# EAGLE design i2c_relay (EAGLE 9.6.2)
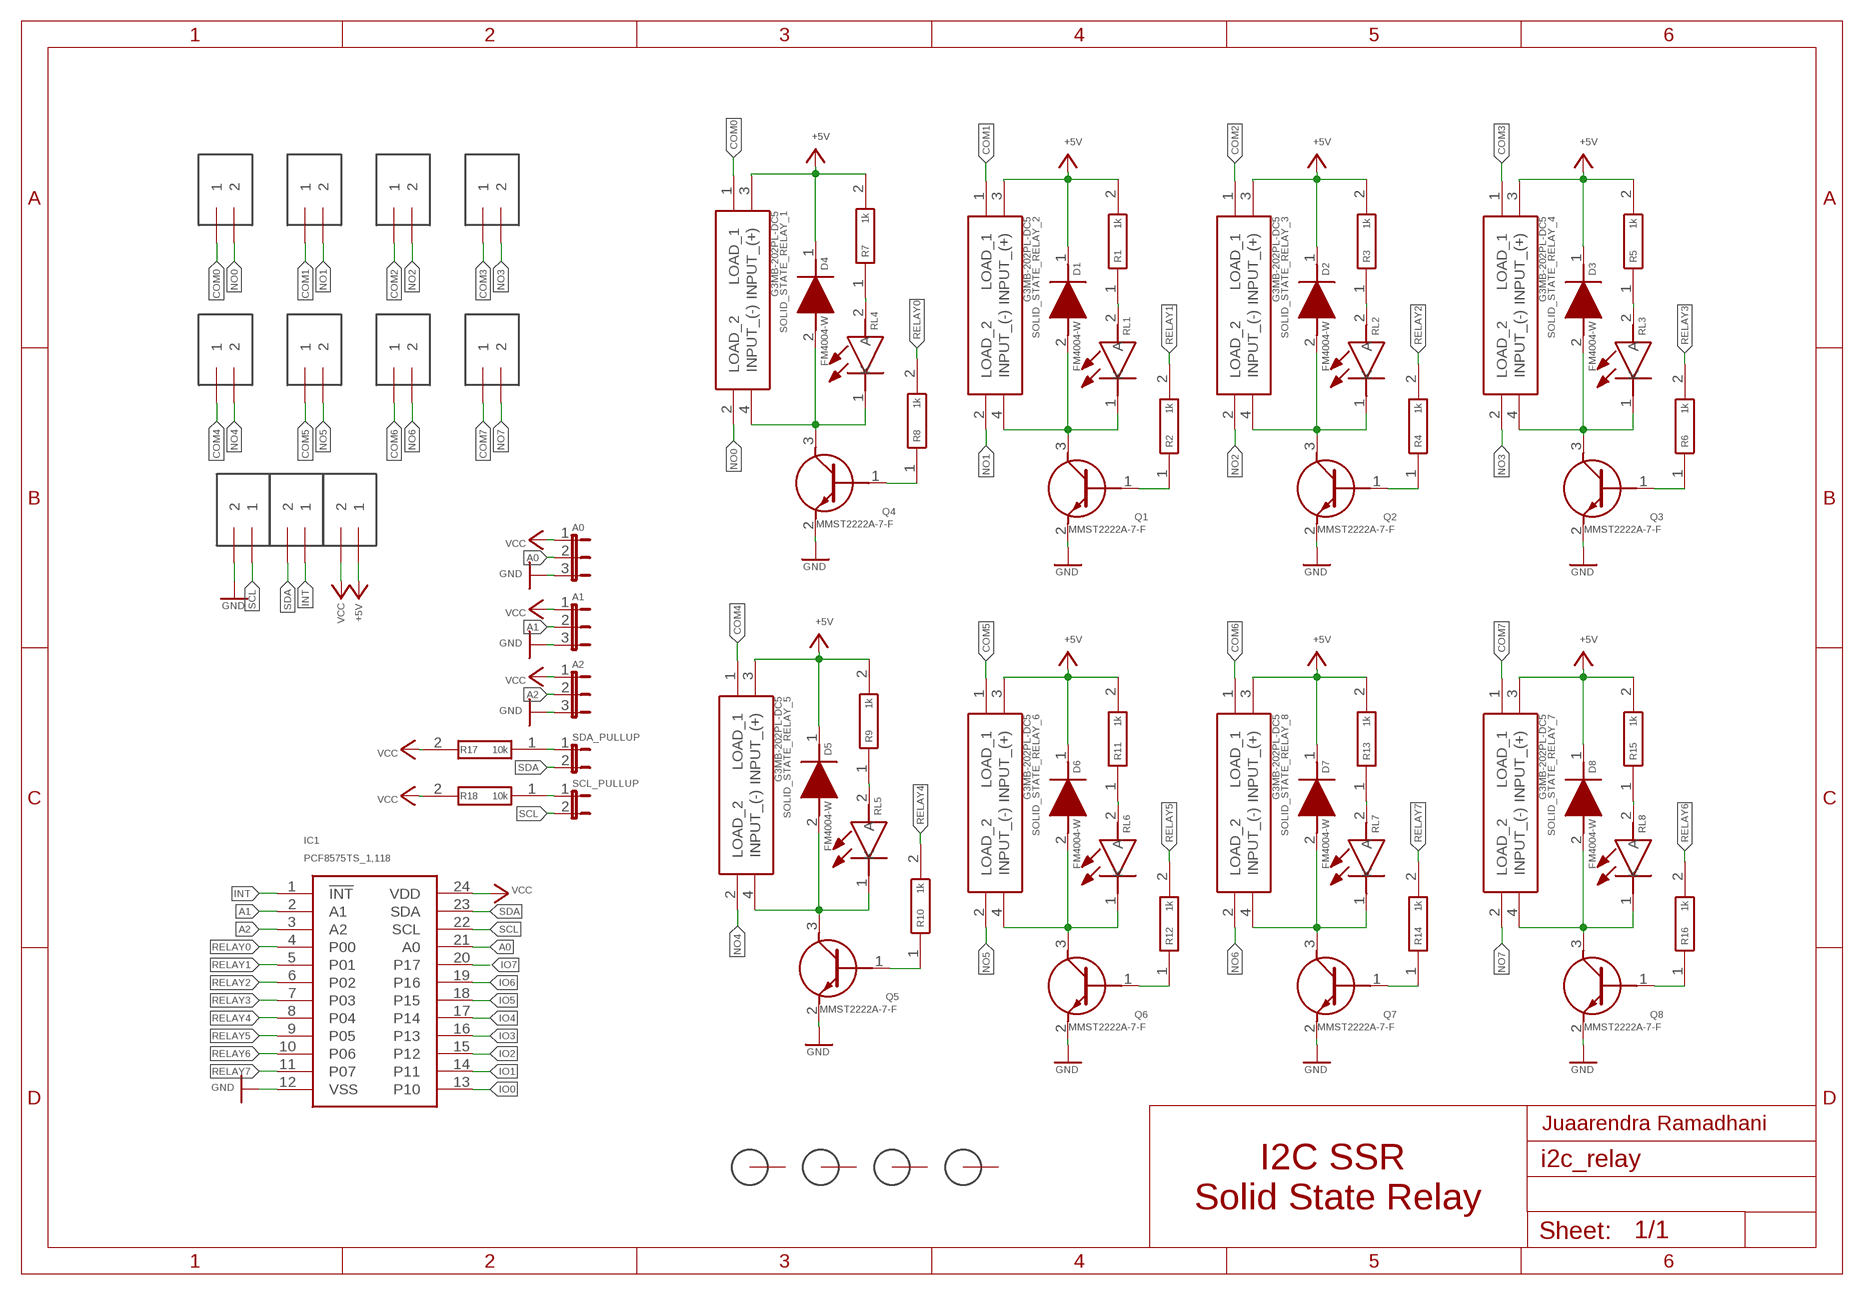
[diagram p0: schematic, sheet 1]

## Parts
A0  JP2E  [JP2]
A1  JP2E  [JP2]
A2  JP2E  [JP2]
D1  FM4004-W  [DIONM5025X231N]
D2  FM4004-W  [DIONM5025X231N]
D3  FM4004-W  [DIONM5025X231N]
D4  FM4004-W  [DIONM5025X231N]
D5  FM4004-W  [DIONM5025X231N]
D6  FM4004-W  [DIONM5025X231N]
D7  FM4004-W  [DIONM5025X231N]
D8  FM4004-W  [DIONM5025X231N]
H1  3MM_HOLE  [3MM_HOLE]
H2  3MM_HOLE  [3MM_HOLE]
H3  3MM_HOLE  [3MM_HOLE]
H4  3MM_HOLE  [3MM_HOLE]
IC1  PCF8575TS_1,118  [SOP65P775X200-24N]
Q1  MMST2222A-7-F  [SOT65P210X110-3N]
Q2  MMST2222A-7-F  [SOT65P210X110-3N]
Q3  MMST2222A-7-F  [SOT65P210X110-3N]
Q4  MMST2222A-7-F  [SOT65P210X110-3N]
Q5  MMST2222A-7-F  [SOT65P210X110-3N]
Q6  MMST2222A-7-F  [SOT65P210X110-3N]
Q7  MMST2222A-7-F  [SOT65P210X110-3N]
Q8  MMST2222A-7-F  [SOT65P210X110-3N]
R1  1k  ERA-3AED102V  [ERA3AEB101V]
R2  1k  ERA-3AED102V  [ERA3AEB101V]
R3  1k  ERA-3AED102V  [ERA3AEB101V]
R4  1k  ERA-3AED102V  [ERA3AEB101V]
R5  1k  ERA-3AED102V  [ERA3AEB101V]
R6  1k  ERA-3AED102V  [ERA3AEB101V]
R7  1k  ERA-3AED102V  [ERA3AEB101V]
R8  1k  ERA-3AED102V  [ERA3AEB101V]
R9  1k  ERA-3AED102V  [ERA3AEB101V]
R10  1k  ERA-3AED102V  [ERA3AEB101V]
R11  1k  ERA-3AED102V  [ERA3AEB101V]
R12  1k  ERA-3AED102V  [ERA3AEB101V]
R13  1k  ERA-3AED102V  [ERA3AEB101V]
R14  1k  ERA-3AED102V  [ERA3AEB101V]
R15  1k  ERA-3AED102V  [ERA3AEB101V]
R16  1k  ERA-3AED102V  [ERA3AEB101V]
R17  10k  ESR03EZPJ103  [RESC1608X55N]
R18  10k  ESR03EZPJ103  [RESC1608X55N]
RL1  150080SS75000  [LEDC2012X80N]
RL2  150080SS75000  [LEDC2012X80N]
RL3  150080SS75000  [LEDC2012X80N]
RL4  150080SS75000  [LEDC2012X80N]
RL5  150080SS75000  [LEDC2012X80N]
RL6  150080SS75000  [LEDC2012X80N]
RL7  150080SS75000  [LEDC2012X80N]
RL8  150080SS75000  [LEDC2012X80N]
SCL_PULLUP  JP1E  [JP1]
SDA_PULLUP  JP1E  [JP1]
SOLID_STATE_RELAY_1  G3MB-202PL-DC5  [G3MB202PLDC5]
SOLID_STATE_RELAY_2  G3MB-202PL-DC5  [G3MB202PLDC5]
SOLID_STATE_RELAY_3  G3MB-202PL-DC5  [G3MB202PLDC5]
SOLID_STATE_RELAY_4  G3MB-202PL-DC5  [G3MB202PLDC5]
SOLID_STATE_RELAY_5  G3MB-202PL-DC5  [G3MB202PLDC5]
SOLID_STATE_RELAY_6  G3MB-202PL-DC5  [G3MB202PLDC5]
SOLID_STATE_RELAY_7  G3MB-202PL-DC5  [G3MB202PLDC5]
SOLID_STATE_RELAY_8  G3MB-202PL-DC5  [G3MB202PLDC5]
U$1  TERMINAL_2P  [KF301-2P]
U$2  TERMINAL_2P  [KF301-2P]
U$3  TERMINAL_2P  [KF301-2P]
U$4  TERMINAL_2P  [KF301-2P]
U$5  TERMINAL_2P  [KF301-2P]
U$6  TERMINAL_2P  [KF301-2P]
U$7  TERMINAL_2P  [KF301-2P]
U$8  TERMINAL_2P  [KF301-2P]
U$9  TERMINAL_2P  [KF301-2P]
U$10  TERMINAL_2P  [KF301-2P]
U$11  TERMINAL_2P  [KF301-2P]

## Nets
+5V: D1.1(K) D2.1(K) D3.1(K) D4.1(K) D5.1(K) D6.1(K) D7.1(K) D8.1(K) R1.2 R3.2 R5.2 R7.2 R9.2 R11.2 R13.2 R15.2 SOLID_STATE_RELAY_1.3(INPUT_(+)) SOLID_STATE_RELAY_2.3(INPUT_(+)) SOLID_STATE_RELAY_3.3(INPUT_(+)) SOLID_STATE_RELAY_4.3(INPUT_(+)) SOLID_STATE_RELAY_5.3(INPUT_(+)) SOLID_STATE_RELAY_6.3(INPUT_(+)) SOLID_STATE_RELAY_7.3(INPUT_(+)) SOLID_STATE_RELAY_8.3(INPUT_(+)) U$11.1
A0: A0.2 IC1.21(A0)
A1: A1.2 IC1.2(A1)
A2: A2.2 IC1.3(A2)
COM0: SOLID_STATE_RELAY_1.1(LOAD_1) U$1.1
COM1: SOLID_STATE_RELAY_2.1(LOAD_1) U$2.1
COM2: SOLID_STATE_RELAY_3.1(LOAD_1) U$3.1
COM3: SOLID_STATE_RELAY_4.1(LOAD_1) U$4.1
COM4: SOLID_STATE_RELAY_5.1(LOAD_1) U$5.1
COM5: SOLID_STATE_RELAY_6.1(LOAD_1) U$6.1
COM6: SOLID_STATE_RELAY_8.1(LOAD_1) U$7.1
COM7: SOLID_STATE_RELAY_7.1(LOAD_1) U$8.1
GND: A0.3 A1.3 A2.3 IC1.12(VSS) Q1.2(E) Q2.2(E) Q3.2(E) Q4.2(E) Q5.2(E) Q6.2(E) Q7.2(E) Q8.2(E) U$9.2
INT: IC1.1(!INT) U$10.1
IO0: IC1.13(P10)
IO1: IC1.14(P11)
IO2: IC1.15(P12)
IO3: IC1.16(P13)
IO4: IC1.17(P14)
IO5: IC1.18(P15)
IO6: IC1.19(P16)
IO7: IC1.20(P17)
N$1: R1.1 RL1.2(A)
N$2: D1.2(A) Q1.3(C) RL1.1(K) SOLID_STATE_RELAY_2.4(INPUT_(-))
N$3: Q1.1(B) R2.1
N$4: R3.1 RL2.2(A)
N$5: D2.2(A) Q2.3(C) RL2.1(K) SOLID_STATE_RELAY_3.4(INPUT_(-))
N$6: Q2.1(B) R4.1
N$7: R5.1 RL3.2(A)
N$8: D3.2(A) Q3.3(C) RL3.1(K) SOLID_STATE_RELAY_4.4(INPUT_(-))
N$9: Q3.1(B) R6.1
N$10: R7.1 RL4.2(A)
N$11: D4.2(A) Q4.3(C) RL4.1(K) SOLID_STATE_RELAY_1.4(INPUT_(-))
N$12: Q4.1(B) R8.1
N$13: R9.1 RL5.2(A)
N$14: D5.2(A) Q5.3(C) RL5.1(K) SOLID_STATE_RELAY_5.4(INPUT_(-))
N$15: Q5.1(B) R10.1
N$16: R11.1 RL6.2(A)
N$17: D6.2(A) Q6.3(C) RL6.1(K) SOLID_STATE_RELAY_6.4(INPUT_(-))
N$18: Q6.1(B) R12.1
N$19: R13.1 RL7.2(A)
N$20: D7.2(A) Q7.3(C) RL7.1(K) SOLID_STATE_RELAY_8.4(INPUT_(-))
N$21: Q7.1(B) R14.1
N$22: R15.1 RL8.2(A)
N$23: D8.2(A) Q8.3(C) RL8.1(K) SOLID_STATE_RELAY_7.4(INPUT_(-))
N$24: Q8.1(B) R16.1
N$25: R17.1 SDA_PULLUP.1
N$27: R18.1 SCL_PULLUP.1
NO0: SOLID_STATE_RELAY_1.2(LOAD_2) U$1.2
NO1: SOLID_STATE_RELAY_2.2(LOAD_2) U$2.2
NO2: SOLID_STATE_RELAY_3.2(LOAD_2) U$3.2
NO3: SOLID_STATE_RELAY_4.2(LOAD_2) U$4.2
NO4: SOLID_STATE_RELAY_5.2(LOAD_2) U$5.2
NO5: SOLID_STATE_RELAY_6.2(LOAD_2) U$6.2
NO6: SOLID_STATE_RELAY_8.2(LOAD_2) U$7.2
NO7: SOLID_STATE_RELAY_7.2(LOAD_2) U$8.2
RELAY0: IC1.4(P00) R8.2
RELAY1: IC1.5(P01) R2.2
RELAY2: IC1.6(P02) R4.2
RELAY3: IC1.7(P03) R6.2
RELAY4: IC1.8(P04) R10.2
RELAY5: IC1.9(P05) R12.2
RELAY6: IC1.10(P06) R16.2
RELAY7: IC1.11(P07) R14.2
SCL: IC1.22(SCL) SCL_PULLUP.2 U$9.1
SDA: IC1.23(SDA) SDA_PULLUP.2 U$10.2
VCC: A0.1 A1.1 A2.1 IC1.24(VDD) R17.2 R18.2 U$11.2
Unconnected: H1.P$1(GND) H1.P$2(GND) H1.P$3(GND) H1.P$4(GND) H1.P$5(GND) H1.P$6(GND) H1.P$7(GND) H1.P$8(GND) H1.P$9(GND) H2.P$1(GND) H2.P$2(GND) H2.P$3(GND) H2.P$4(GND) H2.P$5(GND) H2.P$6(GND) H2.P$7(GND) H2.P$8(GND) H2.P$9(GND) H3.P$1(GND) H3.P$2(GND) H3.P$3(GND) H3.P$4(GND) H3.P$5(GND) H3.P$6(GND) H3.P$7(GND) H3.P$8(GND) H3.P$9(GND) H4.P$1(GND) H4.P$2(GND) H4.P$3(GND) H4.P$4(GND) H4.P$5(GND) H4.P$6(GND) H4.P$7(GND) H4.P$8(GND) H4.P$9(GND)

## Notes on the sheet
- Juaarendra Ramadhani
- I2C SSR 
  Solid State Relay

## Library data of the parts
A0 A1 A2 = jumper:JP2E: JUMPER
D1-D8 = FM4004-W:FM4004-W: Rectifiers 1N4004 1A 400V Source: Datasheet <https://componentsearchengine.com/Datasheets/1/FM4004-W.pdf>; DESCRIPTION: Rectifiers 1N4004 1A 400V; HEIGHT: 2.31mm; MANUFACTURER_NAME: Rectron; MANUFACTURER_PART_NUMBER: FM4004-W; MOUSER_PART_NUMBER: 583-FM4004; MOUSER_PRICE-STOCK: https://www.mouser.co.uk/ProductDetail/Rectron/FM4004-W?qs=Iw9Ubr57Px3IHNH1bE4l9w%3D%3D
H1-H4 = 3mm_special_hole:3MM_HOLE: Cool looking 3mm hole with ground connection
IC1 = SamacSys_Parts:PCF8575TS_1,118: Interface - I/O Expanders Source: Datasheet <http://www.nxp.com/docs/en/data-sheet/PCF8575C.pdf>; DESCRIPTION: Interface - I/O Expanders; DIGIKEY_PARTNUMBER: 568-1079-1-ND; DIGIKEY_PRICE-STOCK: https://www.digikey.com/product-detail/en/nxp-usa-inc/PCF8575TS-1-118/568-1079-1-ND/735793; HEIGHT: 2mm; MANUFACTURER_NAME: NXP; MANUFACTURER_PART_NUMBER: PCF8575TS/1,118; MOUSER_PART_NUMBER: 771-PCF8575TSDB-T; MOUSER_PRICE-STOCK: https://www.mouser.co.uk/ProductDetail/NXP-Semiconductors/PCF8575TS-1118?qs=LOCUfHb8d9vMl26vh33NWQ%3D%3D
Q1-Q8 = MMST2222A-7-F:MMST2222A-7-F: Bipolar (BJT) Transistor NPN 40 V 600 mA 300MHz 200 mW Surface Mount SOT-323 Source: Datasheet <https://www.diodes.com/assets/Datasheets/ds30080.pdf>; DESCRIPTION: Bipolar (BJT) Transistor NPN 40 V 600 mA 300MHz 200 mW Surface Mount SOT-323; HEIGHT: 1.1mm; MANUFACTURER_NAME: Diodes Incorporated; MANUFACTURER_PART_NUMBER: MMST2222A-7-F; MOUSER_PART_NUMBER: 621-MMST2222A-F; MOUSER_PRICE-STOCK: https://www.mouser.co.uk/ProductDetail/Diodes-Incorporated/MMST2222A-7-F?qs=B0AElM0L7fPu4CagNNXsRQ%3D%3D
R1-R16 = ERA-3AED102V:ERA-3AED102V: Thin Film Resistors - SMD 0603 1000ohms 25ppm 0.5% AEC-Q200 Source: Datasheet <https://industrial.panasonic.com/cdbs/www-data/pdf/RDM0000/AOA0000C307.pdf>; DESCRIPTION: Thin Film Resistors - SMD 0603 1000ohms 25ppm 0.5% AEC-Q200; HEIGHT: 0.55mm; MANUFACTURER_NAME: Panasonic; MANUFACTURER_PART_NUMBER: ERA-3AED102V; MOUSER_PART_NUMBER: 667-ERA-3AED102V; MOUSER_PRICE-STOCK: https://www.mouser.co.uk/ProductDetail/Panasonic/ERA-3AED102V?qs=yocZuyCaXdNrh6oeFjCchg%3D%3D
R17 R18 = AccesControlNFC:ESR03EZPJ103: Thick Film Resistors - SMD 0603 10Kohm 5% Anti Surge AEC-Q200 Source: Datasheet <https://componentsearchengine.com/Datasheets/1/ESR03EZPJ103.pdf>; DESCRIPTION: Thick Film Resistors - SMD 0603 10Kohm 5% Anti Surge AEC-Q200; DIGIKEY_PARTNUMBER: RHM10KDCT-ND; DIGIKEY_PRICE-STOCK: https://www.digikey.com/product-detail/en/rohm-semiconductor/ESR03EZPJ103/RHM10KDCT-ND/1762925; HEIGHT: 0.55mm; MANUFACTURER_NAME: ROHM Semiconductor; MANUFACTURER_PART_NUMBER: ESR03EZPJ103; MOUSER_PART_NUMBER: 755-ESR03EZPJ103; MOUSER_PRICE-STOCK: https://www.mouser.com/Search/Refine.aspx?Keyword=755-ESR03EZPJ103
RL1-RL8 = SamacSys_Parts:150080SS75000: Wurth Elektronik 150080SS75000, WL-SMCW Series Red LED, 630 nm, 2012 (0805) Clear, Rectangle Lens SMD Package Source: Datasheet <https://katalog.we-online.com/led/datasheet/150080SS75000.pdf>; DESCRIPTION: Wurth Elektronik 150080SS75000, WL-SMCW Series Red LED, 630 nm, 2012 (0805) Clear, Rectangle Lens SMD Package; DIGIKEY_PARTNUMBER: 732-4985-1-ND; DIGIKEY_PRICE-STOCK: https://www.digikey.com/product-detail/en/w%C3%BCrth-elektronik/150080SS75000/732-4985-1-ND/4489919; HEIGHT: 0.8mm; MANUFACTURER_NAME: Wurth Elektronik; MANUFACTURER_PART_NUMBER: 150080SS75000; MOUSER_PART_NUMBER: 710-150080SS75000; MOUSER_PRICE-STOCK: https://www.mouser.co.uk/ProductDetail/Wurth-Elektronik/150080SS75000?qs=LlUlMxKIyB2zzpiaOzrUdw%3D%3D
SCL_PULLUP SDA_PULLUP = jumper:JP1E: JUMPER
SOLID_STATE_RELAY_1-SOLID_STATE_RELAY_8 = G3MB-202PL-DC5:G3MB-202PL-DC5: Solid State Relays - PCB Mount 5VDC/100-240VAC 2A Source: Datasheet <https://www.mouser.com/datasheet/2/307/g3mb_0609-1189645.pdf>; DESCRIPTION: Solid State Relays - PCB Mount 5VDC/100-240VAC 2A; HEIGHT: 20.5mm; MANUFACTURER_NAME: Omron Electronics; MANUFACTURER_PART_NUMBER: G3MB-202PL-DC5; MOUSER_PART_NUMBER: 653-G3MB-202PL-DC5; MOUSER_PRICE-STOCK: https://www.mouser.co.uk/ProductDetail/Omron-Automation-and-Safety/G3MB-202PL-DC5?qs=CX134%252BdLMDF4X9k4CH7R5g%3D%3D
U$1-U$11 = KF301-2P-Terminal:TERMINAL_2P: Terminal Screw 2 Port 5mm Pitch

## Board
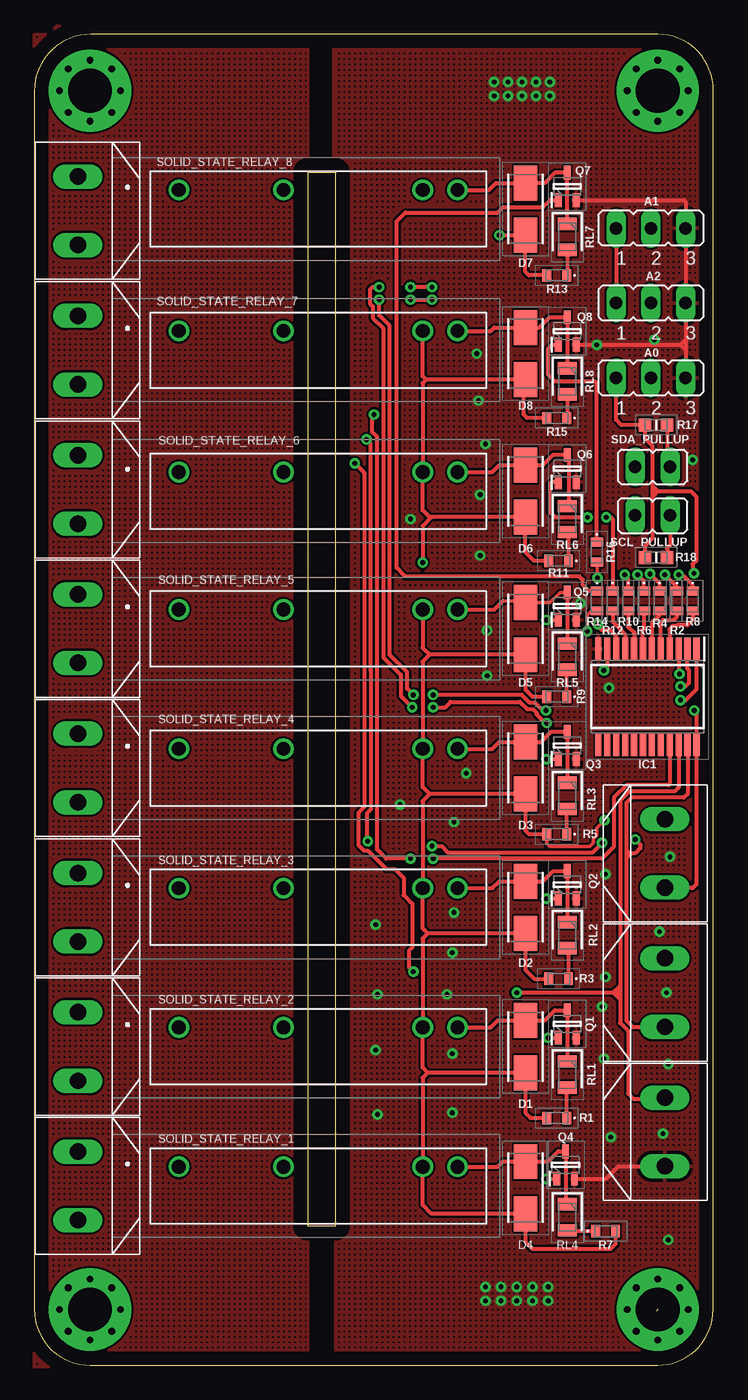
[diagram p1: board, top side]
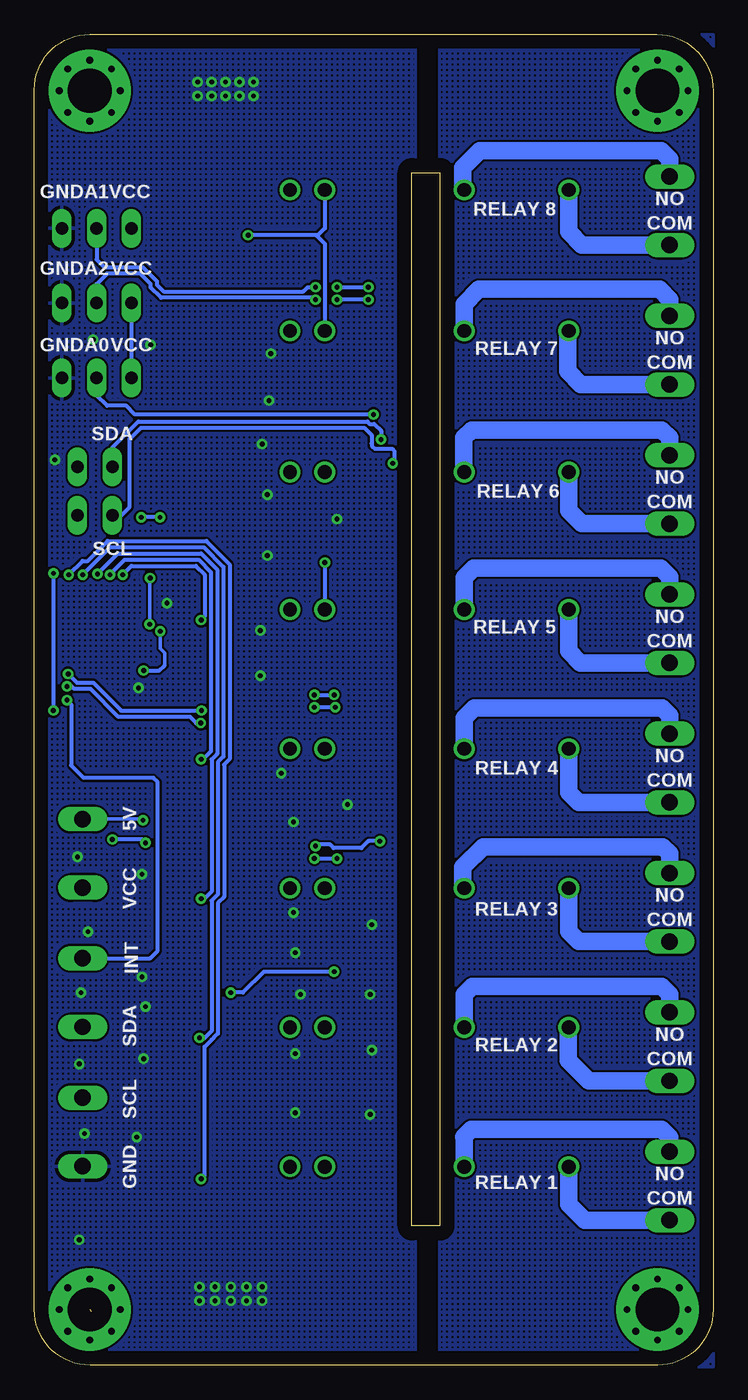
[diagram p2: board, bottom side, seen from below]

Size 49.5 x 97.08 mm. Coordinates in mm from the lower left corner, seen from the top.
Outline: 45.47,4.06 45.34,3.94
Outline: 19.94,86.99 19.94,10.16 21.97,10.16 21.97,86.99 19.94,86.99
Outline: 45.44,0 arc90 49.51,4.06 49.51,93.04 arc90 45.47,97.08 4.12,97.08 arc90 0,92.96 0,4.06 arc90 4.06,0 45.44,0
Copper layers (1*16): Top 0.035mm / dielectric 1.5mm / Bottom 0.035mm
Design rules "default *": minimum track width 6mil, minimum drill 0.35mm, track to track 6mil, track to pad 6mil, pad to pad 6mil, via to via 6mil, smd to smd 6mil, copper to edge 40mil, drill to drill 6mil, minimum pad ring 10mil, minimum via ring 8mil, stop-mask expansion 4mil, vias tented up to drill 0.36mm, thermal gap 10mil

### Footprints (pad centres in the part's own frame; a part is rotated, then mirrored left to right if it is on the bottom)
JP2 = drill 0.914 long: 1 -2.54,0; 2 0,0; 3 2.54,0
DIONM5025X231N = smd 2.55 x 1.7: 1 -1.9,0; 2 1.9,0
3MM_HOLE = drill 3.2 pad 6: P$1 0,0 | drill 0.5 pad 0.61: P$2 0,2.223; P$3 0,-2.223; P$4 2.223,0; P$5 -2.223,0; P$6 -1.587,1.587; P$7 1.587,1.587; P$8 1.587,-1.587; P$9 -1.587,-1.587
SOP65P775X200-24N = smd 1.675 x 0.45: 1 -3.488,3.575; 2 -3.488,2.925; 3 -3.488,2.275; 4 -3.488,1.625; 5 -3.488,0.975; 6 -3.488,0.325; 7 -3.488,-0.325; 8 -3.488,-0.975; 9 -3.488,-1.625; 10 -3.488,-2.275; 11 -3.488,-2.925; 12 -3.488,-3.575; 13 3.488,-3.575; 14 3.488,-2.925; 15 3.488,-2.275; 16 3.488,-1.625; 17 3.488,-0.975; 18 3.488,-0.325; 19 3.488,0.325; 20 3.488,0.975; 21 3.488,1.625; 22 3.488,2.275; 23 3.488,2.925; 24 3.488,3.575
SOT65P210X110-3N = smd 1 x 0.5: 1 -1,0.65; 2 -1,-0.65; 3 1,0
ERA3AEB101V = smd 0.65 x 0.9: 1 -0.725,0; 2 0.725,0
RESC1608X55N = smd 0.9 x 0.95: 1 -0.8,0; 2 0.8,0
LEDC2012X80N = smd 0.9 x 1.4: 1 -0.95,0; 2 0.95,0
JP1 = drill 0.914 long: 1 0,-1.27; 2 0,1.27
G3MB202PLDC5 = drill 1 pad 1.5: 1 0,0; 2 -7.62,0; 3 -17.78,0; 4 -20.32,0
KF301-2P = drill 1.2 pad 1.778 long: 1 -2.5,0; 2 2.5,0

### Placement (x,y rotation side)
A0  44.96,72.01 0 top
A1  44.96,82.93 0 top
A2  44.96,77.47 0 top
D1  35.81,23.24 90 top
D2  35.81,33.4 90 top
D3  35.81,43.56 90 top
D4  35.81,12.95 90 top
D5  35.81,53.72 90 top
D6  35.81,63.75 90 top
D7  35.81,84.33 90 top
D8  35.81,73.79 90 top
H1  4.06,92.96 0 top
H2  4.06,4.06 0 top
H3  45.47,92.96 0 top
H4  45.47,4.06 0 top
IC1  44.7,48.77 270 top
Q1  38.86,24.89 90 top
Q2  38.86,35.05 90 top
Q3  38.86,45.21 90 top
Q4  38.73,14.61 90 top
Q5  38.86,55.37 90 top
Q6  38.86,65.41 90 top
Q7  38.86,85.98 90 top
Q8  38.86,75.44 90 top
R1  38.1,18.03 180 top
R2  46.86,55.75 270 top
R3  38.23,28.19 180 top
R4  45.59,55.75 270 top
R5  38.1,38.73 180 top
R6  44.45,55.75 270 top
R7  41.66,9.78 0 top
R8  48.01,55.75 270 top
R9  38.1,48.77 180 top
R10  43.31,55.75 270 top
R11  38.23,58.67 180 top
R12  42.16,55.75 270 top
R13  38.1,79.5 180 top
R14  41.02,55.75 270 top
R15  38.1,69.09 180 top
R16  41.02,59.31 270 top
R17  45.34,68.58 180 top
R18  45.34,58.93 180 top
RL1  38.86,21.21 270 top
RL2  38.86,31.37 270 top
RL3  38.86,41.53 270 top
RL4  38.86,10.79 270 top
RL5  38.86,51.69 270 top
RL6  38.86,61.72 270 top
RL7  38.86,82.3 270 top
RL8  38.86,71.75 270 top
SCL_PULLUP  45.09,61.98 90 top
SDA_PULLUP  45.09,65.53 90 top
SOLID_STATE_RELAY_1  10.54,14.48 180 top
SOLID_STATE_RELAY_2  10.54,24.64 180 top
SOLID_STATE_RELAY_3  10.54,34.8 180 top
SOLID_STATE_RELAY_4  10.54,44.96 180 top
SOLID_STATE_RELAY_5  10.54,55.12 180 top
SOLID_STATE_RELAY_6  10.54,65.15 180 top
SOLID_STATE_RELAY_7  10.54,75.44 180 top
SOLID_STATE_RELAY_8  10.54,85.72 180 top
U$1  3.17,13.08 90 top
U$2  3.17,23.24 90 top
U$3  3.17,33.4 90 top
U$4  3.17,43.56 90 top
U$5  3.17,53.72 90 top
U$6  3.17,63.88 90 top
U$7  3.17,84.2 90 top
U$8  3.17,74.04 90 top
U$9  45.97,17.02 270 top
U$10  45.97,27.18 270 top
U$11  45.97,37.34 270 top

### Tracks (layer width: path | path; a pad name or v marks a point on that pad's centre or on a via)
1
  pour Top (no thermals, hatched): 19.94,-0.13 19.94,97.66 1.65,97.66 1.02,97.03 0,97.03 0,-0.13
2
  pour Bottom (no thermals, hatched): 19.94,0 19.94,97.03 0,97.03 0,-0.13 20.07,-0.13 20.07,0.13
+5V  (via drill 0.35)
  Top 0.254: R5.2 37.38,38.06 37.59,37.85 40.51,37.85 40.74,38.08 40.74,38.37 41.02,38.65 41.02,39.19 v41.58,39.75
  Top 0.305: D8.1 35.69,71.89 | 35.69,71.89 28.57,71.89 | SOLID_STATE_RELAY_7.3 28.32,72.14 28.57,71.89 | R13.2 36.07,79.5 35.81,79.76 D7.1 v33.91,82.43 v33.91,82.42 | R15.2 35.94,69.09 35.69,69.34 35.69,71.89 | R11.2 36.45,58.67 35.81,59.31 D6.1 28.96,61.85 | 28.96,61.85 28.82,61.85 28.32,62.36 SOLID_STATE_RELAY_6.3 28.32,71.64 28.57,71.89 | SOLID_STATE_RELAY_5.3 28.32,52.32 28.82,51.82 | 28.82,51.82 D5.1 35.81,49.28 36.32,48.77 R9.2 | 28.83,41.66 D3.1 35.81,38.99 36.07,38.73 R5.2 | 28.83,41.66 28.82,41.66 28.32,42.16 SOLID_STATE_RELAY_4.3 28.32,51.32 28.82,51.82 | 28.7,31.5 D2.1 35.81,28.83 36.45,28.19 R3.2 | 28.7,31.5 28.32,31.88 SOLID_STATE_RELAY_3.3 28.32,41.15 28.83,41.66 | 28.7,21.34 D1.1 35.81,18.41 36.2,18.03 R1.2 | 28.7,21.34 28.32,21.72 SOLID_STATE_RELAY_2.3 28.32,31.12 28.7,31.5 | R7.2 42.38,8.85 42.04,8.51 36.32,8.51 35.81,9.02 D4.1 28.95,11.05 28.32,11.68 SOLID_STATE_RELAY_1.3 28.32,20.96 28.7,21.34 | 28.96,61.85 28.32,61.22 v28.32,58.55
  Bottom 0.254: v41.58,39.75 41.67,39.84 U$11.1
  Bottom 0.305: SOLID_STATE_RELAY_8.3 28.32,82.93 28.83,82.42 28.96,82.42 | 28.96,82.42 v33.91,82.42 | 28.96,82.42 28.32,81.79 SOLID_STATE_RELAY_7.3 | v28.32,58.55 SOLID_STATE_RELAY_5.3
A0  (via drill 0.35)
  Top 0.305: IC1.21 46.33,42.42 46.23,42.32 43.18,42.32 42.27,41.4 42.27,37.82 41.4,36.96 v29.08,36.96 | v27.43,36.96 25.65,36.96 24.99,37.62 24.99,67.72 24.64,68.07 24.64,69.21 v24.77,69.34
  Bottom 0.305: v29.08,36.96 v27.43,36.96 | v24.77,69.34 42.16,69.34 42.8,69.98 44.2,69.98 44.96,70.74 A0.2
A1  (via drill 0.35)
  Top 0.305: v29,78.63 v27.43,78.63 | v25.15,78.63 24.66,78.63 24.46,78.44 24.46,77.44 24.69,77.21 24.69,76.39 25.45,75.63 25.45,51.63 26.72,50.36 26.72,48.82 v27.56,47.99 | v29.08,47.99 29.95,47.99 30.35,48.39 35.41,48.39 35.94,47.85 36.34,47.85 36.63,47.56 36.63,47.47 37.25,46.84 v37.37,46.84 | v47.12,49.51 47.48,49.51 47.75,49.78 47.75,50.67 47.62,50.8 IC1.2
  Bottom 0.305: A1.2 44.96,80.64 44.4,80.09 41.59,80.09 40.56,79.06 40.56,78.8 40.07,78.31 29.9,78.31 29.57,78.63 v29,78.63 | v27.43,78.63 v25.15,78.63 | v27.56,47.99 v29.08,47.99 | v37.37,46.84 37.7,46.84 38.15,47.3 43.37,47.3 45.4,49.33 46.59,49.33 46.78,49.51 v47.12,49.51
A2  (via drill 0.35)
  Top 0.305: IC1.3 46.98,50.48 v47.04,50.42 | v37.31,47.75 37.08,47.75 36.52,48.31 36.13,48.31 35.55,48.9 v29.08,48.9 | v27.64,48.9 27.18,49.36 27.18,50.55 25.91,51.82 25.91,75.82 25.15,76.58 v25.15,77.72 | v27.43,77.72 v29,77.72
  Bottom 0.305: v47.04,50.42 46.4,49.78 45.21,49.78 43.18,47.75 v37.31,47.75 | v29.08,48.9 v27.64,48.9 | v25.15,77.72 v27.43,77.72 | v29,77.72 29.13,77.85 40.26,77.85 41.02,78.61 41.02,78.87 41.78,79.63 44.2,79.63 44.96,78.87 A2.2
COM0
  Bottom 1.27: U$1.1 9.37,10.58 10.54,11.75 SOLID_STATE_RELAY_1.1
COM1
  Bottom 1.27: U$2.1 9.07,20.74 10.57,22.24 10.57,24.61 SOLID_STATE_RELAY_2.1
COM2
  Bottom 1.27: U$3.1 9.79,30.9 10.54,31.65 SOLID_STATE_RELAY_3.1
COM3
  Bottom 1.27: U$4.1 9.82,41.06 10.54,41.78 SOLID_STATE_RELAY_4.1
COM4
  Bottom 1.27: U$5.1 9.68,51.22 10.54,52.08 SOLID_STATE_RELAY_5.1
COM5
  Bottom 1.27: U$6.1 9.58,61.38 10.54,62.34 SOLID_STATE_RELAY_6.1
COM6
  Bottom 1.27: U$7.1 9.58,81.7 10.54,82.66 SOLID_STATE_RELAY_8.1
COM7
  Bottom 1.27: SOLID_STATE_RELAY_7.1 10.62,75.36 10.62,72.49 9.67,71.54 U$8.1
GND  (via drill 0.35)
  Top 0.305: Q7.2 47.35,84.98 47.5,84.84 A1.3 A2.3 47.5,74.8 | 47.5,74.8 47.5,74.04 | 47.5,74.04 A0.3 | Q8.2 47.1,74.44 | 47.1,74.44 47.5,74.04 | 47.1,74.44 47.13,74.44 47.5,74.8 | Q4.2 41.67,13.61 42.59,14.52 U$9.2
  other vias: 33.53,93.6 34.54,93.6 35.56,93.6 36.58,93.6 37.59,93.6 37.59,92.58 36.58,92.58 35.56,92.58 34.54,92.58 33.53,92.58 41.91,49.4 33.02,53.59 33.02,50.29 32.51,59.05 32.51,63.5 32.89,67.18 32.38,70.36 32.26,73.79 45.21,74.8 41.02,74.42 48.01,66.04 46.35,37.08 41.66,35.81 45.59,31.62 46.1,27.18 41.4,26.16 41.66,28.32 46.23,21.97 41.53,22.35 45.85,16.89 42.04,16.64 46.23,9.14 37.47,5.71 36.32,5.71 35.18,5.71 34.04,5.71 32.89,5.71 32.89,4.7 34.04,4.7 35.18,4.7 36.32,4.7 37.47,4.7 25.02,18.29 30.48,18.41 30.48,22.73 24.89,22.99 30.1,27.05 25.02,27.05 24.89,32.13 30.61,33.02 30.48,30.1 30.61,39.62 26.67,40.89 31.5,43.18 27.43,61.72 39.83,55.59
  pour Top (hatched): 21.97,87.12 21.97,0 49.4,0 49.4,97.03 21.84,97.03 21.84,87.25
  pour Bottom (hatched): 22.86,0 49.53,0.13 49.53,96.9 21.72,96.9 21.72,0 21.97,0
INT  (via drill 0.35)
  Top 0.305: IC1.1 48.28,49.3 47.5,48.51 v47.12,48.51
  Bottom 0.305: U$10.1 41.06,29.68 40.51,30.23 40.51,42.53 40.83,42.85 45.91,42.85 46.81,43.75 46.81,48.21 v47.12,48.51
N$1
  Top 0.305: R1.1 38.83,20.22 RL1.2
N$2
  Top 0.305: SOLID_STATE_RELAY_2.4 33.27,24.64 33.78,25.15 D1.2 37.21,25.14 37.96,25.89 Q1.3 RL1.1
N$3  (via drill 0.35)
  Top 0.305: R2.1 46.86,56.77 v45.97,57.66 | v37.47,23.88 37.48,23.89 Q1.1
  Bottom 0.305: v45.97,57.66 43.97,59.66 37.15,59.66 35.71,58.23 35.71,44.4 36.12,44 36.12,34.36 36.58,33.9 36.58,24.38 37.08,23.88 v37.47,23.88
N$4
  Top 0.305: R3.1 38.95,30.33 RL2.2
N$5
  Top 0.305: SOLID_STATE_RELAY_3.4 33.4,34.8 33.9,35.3 D2.2 37.08,35.3 37.83,36.05 Q2.3 RL2.1
N$6  (via drill 0.35)
  Top 0.305: R4.1 45.59,57.02 v44.9,57.72 | v37.34,34.04 37.35,34.05 Q2.1
  Bottom 0.305: v44.9,57.72 43.41,59.21 37.34,59.21 36.17,58.04 36.17,44.59 36.58,44.18 36.58,34.54 37.08,34.04 v37.34,34.04
N$7
  Top 0.305: R5.1 38.83,40.54 RL3.2
N$8
  Top 0.305: SOLID_STATE_RELAY_4.4 33.4,44.96 33.9,45.46 D3.2 36.95,45.46 37.7,46.21 Q3.3 RL3.1
N$9  (via drill 0.35)
  Top 0.305: R6.1 44.45,57.2 v43.99,57.66 | v37.34,44.2 37.35,44.21 Q3.1
  Bottom 0.305: v43.99,57.66 43.74,57.91 43.74,57.94 42.93,58.75 37.53,58.75 36.63,57.85 36.63,44.78 37.21,44.2 v37.34,44.2
N$10
  Top 0.305: R7.1 38.93,9.78 RL4.2
N$11
  Top 0.305: SOLID_STATE_RELAY_1.4 33.78,14.48 34.16,14.85 D4.2 37.46,14.85 38.21,15.61 Q4.3 38.73,11.87 RL4.1
N$12  (via drill 0.35)
  Top 0.305: R8.1 48.01,56.9 47.24,57.66 v46.99,57.66 | v37.34,13.59 37.35,13.61 Q4.1
  Bottom 0.305: v37.34,13.59 37.08,13.84 37.08,23.23 36.57,23.74 36.44,23.87 36.12,24.2 36.12,33.71 35.66,34.16 35.66,43.81 35.26,44.21 35.26,58.42 36.96,60.12 44.16,60.12 45.6,58.67 45.97,58.67 v46.99,57.66
N$13
  Top 0.305: R9.1 38.83,50.7 RL5.2
N$14
  Top 0.254: 34.16,55.75 35.68,55.75 D5.2 37.59,55.62 38.34,56.37 Q5.3
  Top 0.305: SOLID_STATE_RELAY_5.4 33.53,55.12 34.16,55.75 | Q5.3 RL5.1
N$15  (via drill 0.35)
  Top 0.305: R10.1 43.31,57.4 v43.05,57.66 | v37.34,54.36 37.35,54.37 Q5.1
  Bottom 0.305: v43.05,57.66 42.42,58.29 37.72,58.29 37.08,57.66 37.08,54.61 v37.34,54.36
N$16
  Top 0.305: R11.1 38.95,60.68 RL6.2
N$17
  Top 0.305: SOLID_STATE_RELAY_6.4 33.4,65.15 33.9,65.65 D6.2 37.08,65.65 37.83,66.41 Q6.3 38.96,66.31 38.96,62.77 RL6.1
N$18  (via drill 0.35)
  Top 0.305: Q6.1 37.73,64.41 37.59,64.26 37.59,62.23 37.97,61.85 v40.34,61.85 | v41.7,61.85 42.04,61.85 42.16,61.72 R12.1
  Bottom 0.305: v40.34,61.85 v41.7,61.85
N$19
  Top 0.305: RL7.2 38.86,79.54 R13.1
N$20
  Top 0.305: SOLID_STATE_RELAY_8.4 33.15,85.72 33.65,86.23 D7.2 37.21,86.23 37.96,86.98 Q7.3 RL7.1
N$21
  Top 0.305: R14.1 40.42,56.48 40.01,56.9 40.01,57.28 39.75,57.53 27.05,57.53 26.42,58.17 26.42,83.44 27.05,84.07 33.78,84.07 34.16,84.45 37.08,84.45 37.61,84.98 Q7.1
N$22
  Top 0.305: RL8.2 38.86,69.12 R15.1
N$23
  Top 0.305: SOLID_STATE_RELAY_7.4 33.27,75.44 33.53,75.69 D8.2 36.83,75.69 37.58,76.44 Q8.3 RL8.1
N$24
  Top 0.305: R16.1 41.02,71.63 40.89,71.75 37.97,71.75 37.47,72.26 37.47,74.17 37.73,74.44 Q8.1
N$25
  Top 0.305: R17.1 46.14,65.75 SDA_PULLUP.1
N$27
  Top 0.305: SCL_PULLUP.1 46.35,59.82 46.14,59.6 R18.1
NO0
  Bottom 1.27: U$1.2 3.17,16.61 3.77,17.21 17.63,17.21 18.17,16.66 18.16,16.65 SOLID_STATE_RELAY_1.2
NO1
  Bottom 1.27: U$2.2 3.17,27.05 3.75,27.62 17.58,27.62 18.16,27.04 SOLID_STATE_RELAY_2.2
NO2
  Bottom 1.27: SOLID_STATE_RELAY_3.2 18.25,34.89 18.25,36.35 16.78,37.82 3.68,37.82 3.17,37.31 U$3.2
NO3
  Bottom 1.27: U$4.2 3.17,47.41 3.72,47.96 17.41,47.96 18.16,47.21 SOLID_STATE_RELAY_4.2
NO4
  Bottom 1.27: U$5.2 3.17,57.51 3.81,58.14 17.46,58.14 18.16,57.44 SOLID_STATE_RELAY_5.2
NO5
  Bottom 1.27: U$6.2 3.17,67.65 3.75,68.22 17.61,68.22 18.17,67.67 18.17,65.16 SOLID_STATE_RELAY_6.2
NO6
  Bottom 1.27: U$7.2 3.17,87.96 3.79,88.57 17.03,88.57 18.25,87.35 18.25,85.81 SOLID_STATE_RELAY_8.2
NO7
  Bottom 1.27: U$8.2 3.17,77.74 3.91,78.47 17.08,78.47 18.16,77.39 SOLID_STATE_RELAY_7.2
RELAY0
  Top 0.305: R8.2 48.01,54.36 47.62,53.98 46.88,53.98 46.8,53.9 46.53,53.9 46.33,53.7 IC1.4
RELAY1
  Top 0.305: IC1.5 45.68,54.18 45.86,54.36 46.61,54.36 46.86,54.61 R2.2
RELAY2
  Top 0.305: R4.2 45.59,54.74 45.03,54.17 IC1.6
RELAY3
  Top 0.305: R6.2 44.45,53.72 44.32,53.59 44.32,52.31 IC1.7
RELAY4
  Top 0.305: R10.2 43.31,53.85 43.73,53.43 IC1.8
RELAY5
  Top 0.305: R12.2 42.16,54.23 43.08,53.31 IC1.9
RELAY6  (via drill 0.35)
  Top 0.254: 41.02,53.98 v41.09,54.05 | v41.06,57.42 41.06,58.55 R16.2
  Top 0.305: IC1.10 42.43,53.2 42.04,53.59 41.4,53.59 41.02,53.98
  Bottom 0.254: v41.09,54.05 41.09,57.38 v41.06,57.42
RELAY7  (via drill 0.35)
  Top 0.254: v40.32,53.53 40.32,54.72 40.63,55.03 R14.2
  Top 0.305: IC1.11 41.78,50.92 v41.53,50.67
  Bottom 0.254: 40.01,51.05 40.01,51.94 40.32,52.26 v40.32,53.53
  Bottom 0.305: v41.53,50.67 40.39,50.67 40.01,51.05
SCL  (via drill 0.35)
  Top 0.305: IC1.22 46.98,42.15 46.69,41.86 43.37,41.86 42.72,41.21 42.72,27.69 | 42.72,27.69 42.72,27.18 | 42.72,27.18 42.72,26.67 | 42.72,26.67 42.72,24.96 43.31,24.37 43.31,19.81 43.69,19.43 45.89,19.43 U$9.1 | v23.37,65.79 24.05,65.1 24.05,40.7 23.63,40.28 23.63,37.94 24.03,37.54 24.3,37.54 25.65,36.2 26.29,36.2 26.92,35.56 26.92,34.29 27.56,33.66 27.56,30.48 27.3,30.23 27.3,29.04 v27.64,28.7 | v35.18,27.18 42.22,27.18 | 42.22,27.18 42.72,27.69 | 42.22,27.18 42.72,26.67 | 42.22,27.18 42.72,27.18
  Bottom 0.305: SCL_PULLUP.2 43.18,61.98 42.55,62.61 42.55,67.55 41.72,68.38 25.45,68.38 24.9,67.83 24.9,67.24 24.89,67.23 24.89,67.06 24.68,66.84 23.41,66.84 23.24,66.67 23.24,65.91 v23.37,65.79 | v27.64,28.7 32.77,28.7 34.29,27.18 v35.18,27.18
SDA  (via drill 0.35)
  Top 0.305: IC1.23 47.63,41.66 47.37,41.4 43.56,41.4 43.18,41.02 43.18,37.59 | U$10.2 43.65,24.68 43.18,25.15 43.18,36.96 | 43.18,37.59 43.18,37.34 | 43.18,37.34 43.18,36.96 | v24.22,67.53 24.51,67.23 24.51,50.67 24.54,50.65 24.54,40.54 24.26,40.26 24.26,38.28 v24.31,38.23 | v29,37.87 29.7,37.87 30.15,37.41 40.72,37.41 v41.4,38.1 | v43.81,38.35 44.2,37.97 44.2,37.72 43.81,37.34 43.56,37.34 | 43.43,37.34 43.18,37.34 | 43.56,37.34 43.43,37.34 | 43.43,37.34 43.18,37.59 | 43.56,37.34 43.18,36.96
  Bottom 0.305: SDA_PULLUP.2 43.81,66.93 41.91,68.83 25.23,68.83 25.05,68.66 24.72,68.66 24.22,68.16 v24.22,67.53 | v24.31,38.23 25.15,38.23 25.65,37.72 27.69,37.72 27.94,37.97 28.9,37.97 v29,37.87 | v41.4,38.1 41.66,38.35 v43.81,38.35
VCC  (via drill 0.35)
  Top 0.305: U$11.2 46.01,34.8 48.01,34.8 48.28,35.07 IC1.24 48.26,45.3 48.26,47.61 v48.12,47.75 | A1.1 A2.1 | A0.1 42.42,68.96 42.8,68.58 R17.2 44.54,67.6 45.09,67.06 45.09,64.14 | R18.2 44.54,59.78 45.09,60.33 45.09,63.37 | 45.09,63.37 45.09,64.14 | 45.09,64.14 45.47,63.75 | v48.11,57.76 48.01,57.86 48.01,58.42 48.26,58.67 48.26,63.37 47.88,63.75 45.47,63.75 | 45.47,63.75 45.09,63.37
  Bottom 0.305: A2.1 A0.1 | v48.11,57.76 48.11,47.76 v48.12,47.75

### Text on the board
bNames: VCC | A1 | GND | NO | RELAY 8 | COM | VCC | A2 | GND | NO | VCC | A0 | GND | RELAY 7 | COM | SDA | NO | RELAY 6 | COM | SCL | NO | RELAY 5 | COM | NO | RELAY 4 | COM | 5V | VCC | NO | COM | RELAY 3 | INT | SDA | NO | RELAY 2 | COM | SCL | GND | NO | RELAY 1 | COM
_bsilk: COM